# Altium project QUTMS 2021 Shutdown Redesign.PrjPcb
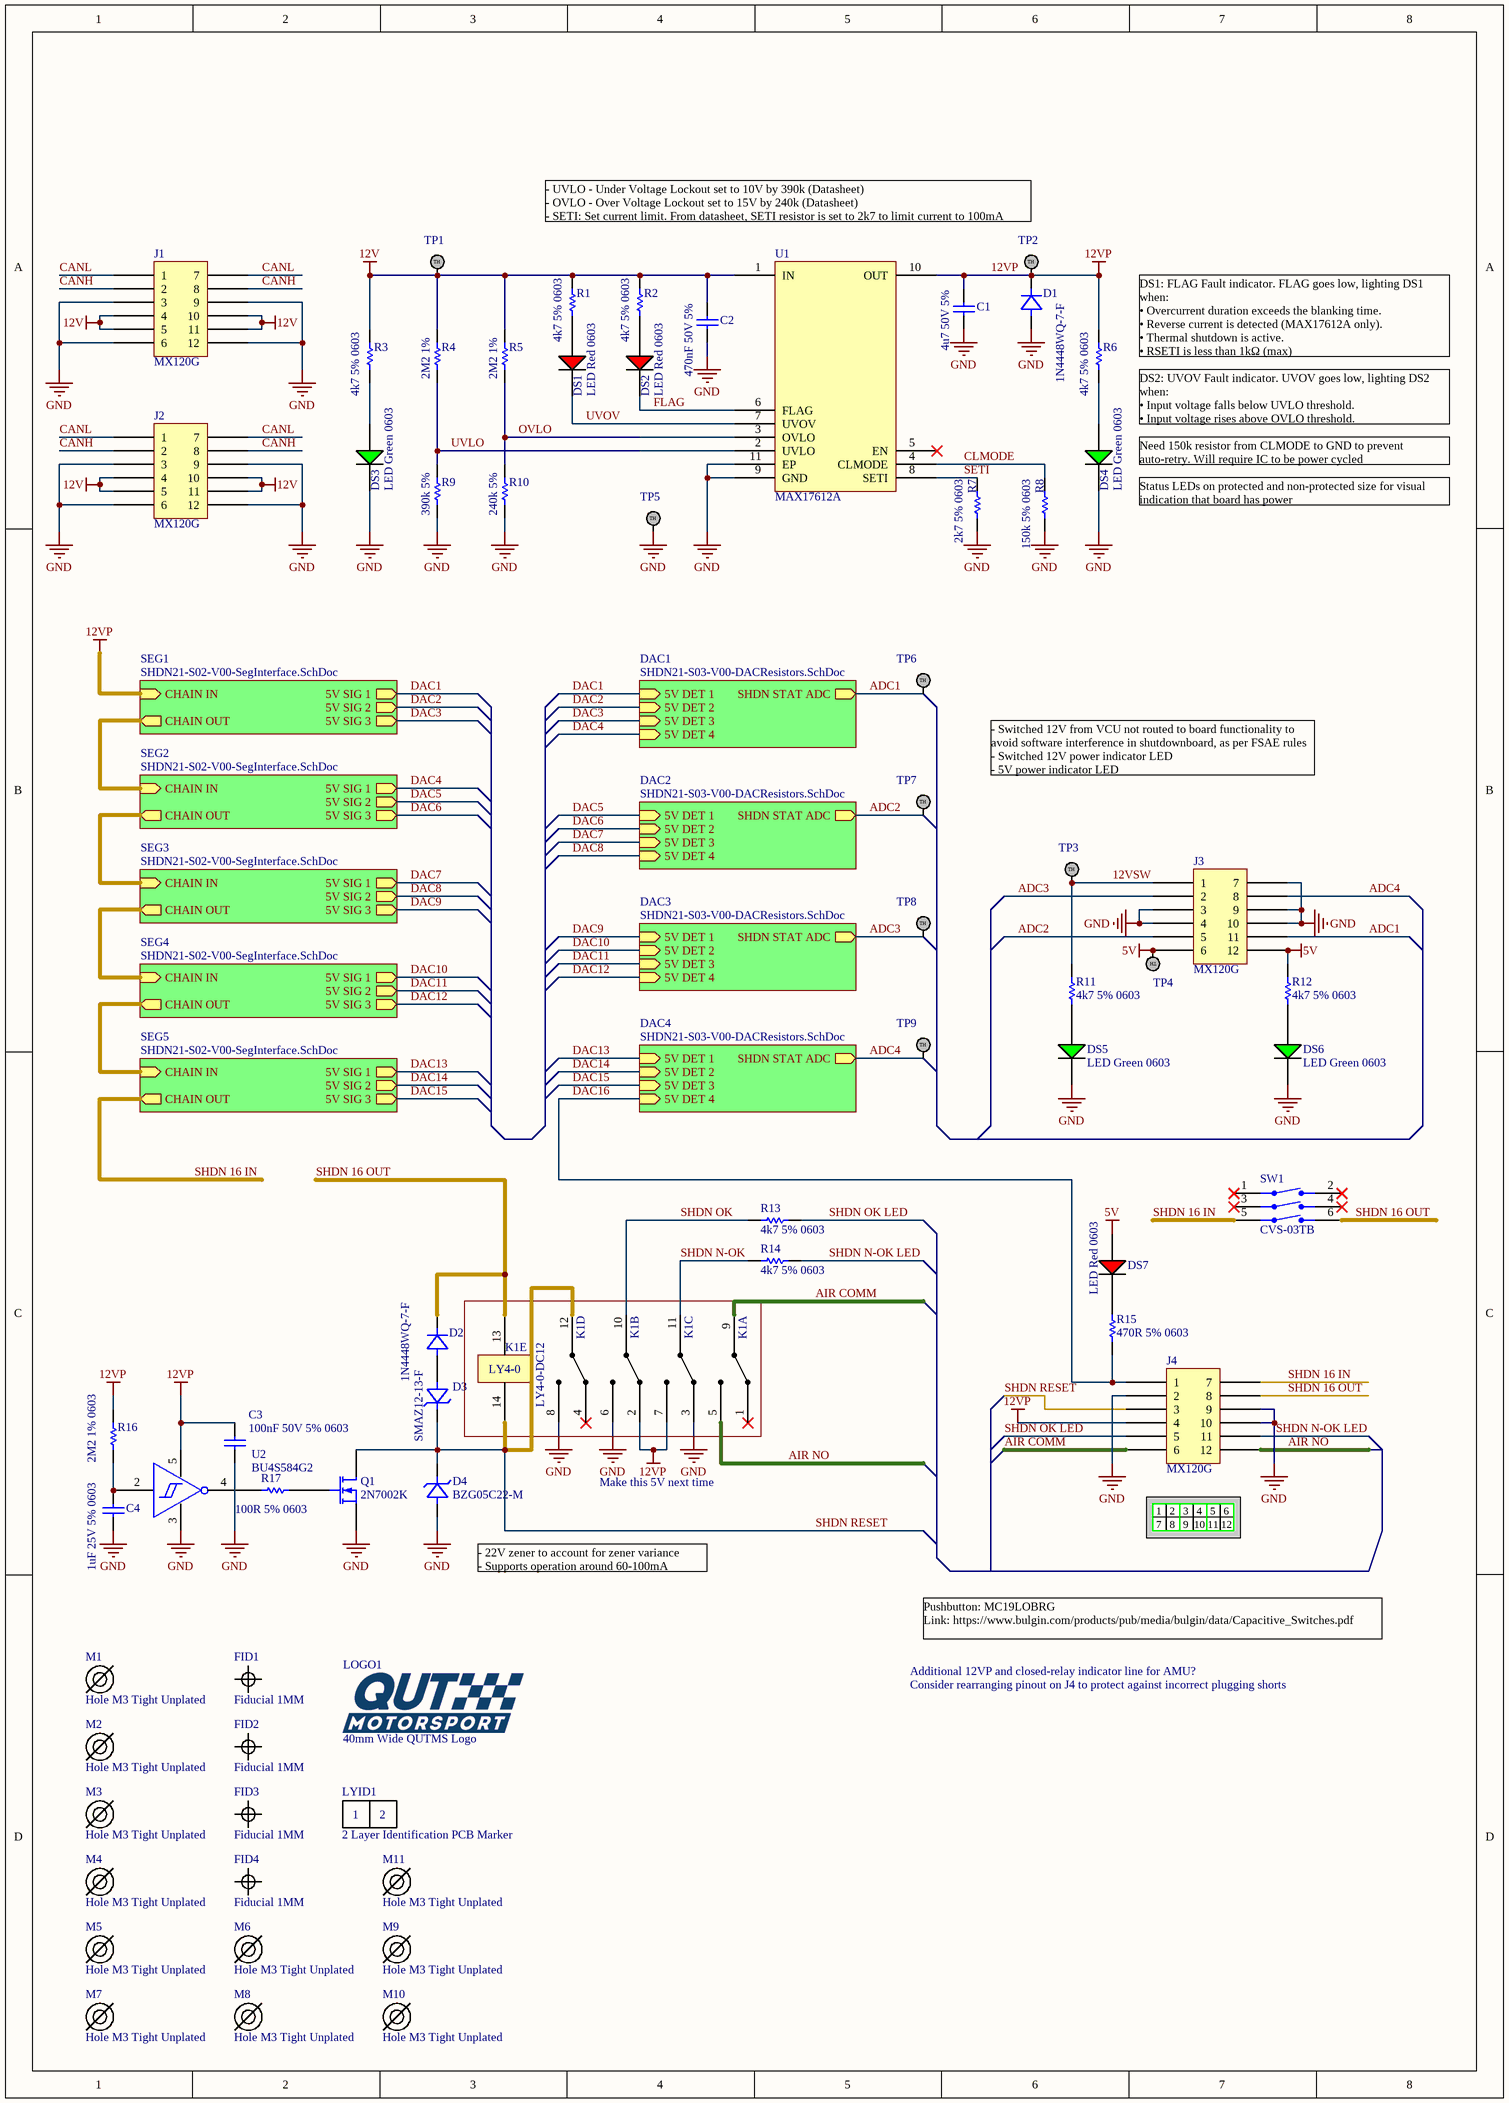
[diagram p0: SHDN21-S01-V00-Shutdown.SchDoc]
3 sheets, 131 parts. Net scope: hierarchical (ports join the sheet entries above them; power ports are global).
Board file: SHDN21-P01-V00.PcbDoc
Sheets:
  SHDN21-S01-V00-Shutdown.SchDoc
    SEG1 = SHDN21-S02-V00-SegInterface.SchDoc
    SEG2 = SHDN21-S02-V00-SegInterface.SchDoc
    SEG3 = SHDN21-S02-V00-SegInterface.SchDoc
    SEG4 = SHDN21-S02-V00-SegInterface.SchDoc
    SEG5 = SHDN21-S02-V00-SegInterface.SchDoc
    DAC1 = SHDN21-S03-V00-DACResistors.SchDoc
    DAC2 = SHDN21-S03-V00-DACResistors.SchDoc
    DAC3 = SHDN21-S03-V00-DACResistors.SchDoc
    DAC4 = SHDN21-S03-V00-DACResistors.SchDoc

## Sheet SHDN21-S01-V00-Shutdown.SchDoc
size A3 portrait

### Parts
C1  4u7 50V 5%  [Cap_Ceramic_0603]
C2  470nF 50V 5%  [Cap_Ceramic_0603]
C3  100nF 50V 5% 0603  [Cap_Ceramic_0603]
C4  1uF 25V 5% 0603  [Cap_Ceramic_0603]
D1  1N4448WQ-7-F  [SMA]
D2  1N4448WQ-7-F  [SMA]
D3  SMAZ12-13-F  [SMA]
D4  BZG05C22-M  [SMA]
DS1  LED Red 0603  [LED RED 0603]
DS2  LED Red 0603  [LED RED 0603]
DS3  LED Green 0603  [LED GREEN 0603]
DS4  LED Green 0603  [LED GREEN 0603]
DS5  LED Green 0603  [LED GREEN 0603]
DS6  LED Green 0603  [LED GREEN 0603]
DS7  LED Red 0603  [LED RED 0603]
FID1  Fiducial 1MM  [FIDUCIAL 1MM]
FID2  Fiducial 1MM  [FIDUCIAL 1MM]
FID3  Fiducial 1MM  [FIDUCIAL 1MM]
FID4  Fiducial 1MM  [FIDUCIAL 1MM]
J1  MX120G  [MX120G]
J2  MX120G  [MX120G]
J3  MX120G  [MX120G]
J4  MX120G  [MX120G]
K1  LY4-0-DC12  [LY4-0-DC12]  (value not drawn)  (parts A,B,C,D,E of 5)
LOGO1  40mm Wide QUTMS Logo  [QUTMS LOGO 40MM]
LYID1  2 Layer Identification PCB Marker  [LAYER IDENT 2]
M1  Hole M3 Tight Unplated  [M3.2 UNPLATED]
M2  Hole M3 Tight Unplated  [M3.2 UNPLATED]
M3  Hole M3 Tight Unplated  [M3.2 UNPLATED]
M4  Hole M3 Tight Unplated  [M3.2 UNPLATED]
M5  Hole M3 Tight Unplated  [M3.2 UNPLATED]
M6  Hole M3 Tight Unplated  [M3.2 UNPLATED]
M7  Hole M3 Tight Unplated  [M3.2 UNPLATED]
M8  Hole M3 Tight Unplated  [M3.2 UNPLATED]
M9  Hole M3 Tight Unplated  [M3.2 UNPLATED]
M10  Hole M3 Tight Unplated  [M3.2 UNPLATED]
M11  Hole M3 Tight Unplated  [M3.2 UNPLATED]
Q1  2N7002K  [SOT-23-3]
R1  4k7 5% 0603  [Res_ThinFilm_0603]
R2  4k7 5% 0603  [Res_ThinFilm_0603]
R3  4k7 5% 0603  [Res_ThinFilm_0603]
R4  2M2 1%  [Res_ThinFilm_0603]
R5  2M2 1%  [Res_ThinFilm_0603]
R6  4k7 5% 0603  [Res_ThinFilm_0603]
R7  2k7 5% 0603  [Res_ThinFilm_0603]
R8  150k 5% 0603  [Res_ThinFilm_0603]
R9  390k 5%  [Res_ThinFilm_0603]
R10  240k 5%  [Res_ThinFilm_0603]
R11  4k7 5% 0603  [Res_ThinFilm_0603]
R12  4k7 5% 0603  [Res_ThinFilm_0603]
R13  4k7 5% 0603  [Res_ThinFilm_0603]
R14  4k7 5% 0603  [Res_ThinFilm_0603]
R15  470R 5% 0603  [Res_ThinFilm_0603]
R16  2M2 1% 0603  [Res_ThinFilm_0603]
R17  100R 5% 0603  [Res_ThinFilm_0603]
SW1  CVS-03TB  [CVS-03TB]
TP1  TestPoint  [TestPoint]  (value not drawn)
TP2  TestPoint  [TestPoint]  (value not drawn)
TP3  TestPoint  [TestPoint]  (value not drawn)
TP4  TestPoint  [TestPoint]  (value not drawn)
TP5  TestPoint  [TestPoint]  (value not drawn)
TP6  TestPoint  [TestPoint]  (value not drawn)
TP7  TestPoint  [TestPoint]  (value not drawn)
TP8  TestPoint  [TestPoint]  (value not drawn)
TP9  TestPoint  [TestPoint]  (value not drawn)
U1  MAX17612A  [10-Pin TDFN EP]
U2  BU4S584G2  [SSOP5]

### Sub-sheets
DAC1 = SHDN21-S03-V00-DACResistors.SchDoc: 5V DET 1 (in), SHDN STAT ADC (out), 5V DET 2 (in), 5V DET 3 (in), 5V DET 4 (in)
DAC2 = SHDN21-S03-V00-DACResistors.SchDoc: 5V DET 1 (in), SHDN STAT ADC (out), 5V DET 2 (in), 5V DET 3 (in), 5V DET 4 (in)
DAC3 = SHDN21-S03-V00-DACResistors.SchDoc: 5V DET 1 (in), SHDN STAT ADC (out), 5V DET 2 (in), 5V DET 3 (in), 5V DET 4 (in)
DAC4 = SHDN21-S03-V00-DACResistors.SchDoc: 5V DET 1 (in), SHDN STAT ADC (out), 5V DET 2 (in), 5V DET 3 (in), 5V DET 4 (in)
SEG1 = SHDN21-S02-V00-SegInterface.SchDoc: CHAIN IN (in), 5V SIG 1 (out), 5V SIG 2 (out), 5V SIG 3 (out), CHAIN OUT (out)
SEG2 = SHDN21-S02-V00-SegInterface.SchDoc: CHAIN IN (in), 5V SIG 1 (out), 5V SIG 2 (out), 5V SIG 3 (out), CHAIN OUT (out)
SEG3 = SHDN21-S02-V00-SegInterface.SchDoc: CHAIN IN (in), 5V SIG 1 (out), 5V SIG 2 (out), 5V SIG 3 (out), CHAIN OUT (out)
SEG4 = SHDN21-S02-V00-SegInterface.SchDoc: CHAIN IN (in), 5V SIG 1 (out), 5V SIG 2 (out), 5V SIG 3 (out), CHAIN OUT (out)
SEG5 = SHDN21-S02-V00-SegInterface.SchDoc: CHAIN IN (in), 5V SIG 1 (out), 5V SIG 2 (out), 5V SIG 3 (out), CHAIN OUT (out)

### Nets
5V: DS7.1(A) J3.6 J3.12 R12.2 TP4.1
12V: C2.2 J1.4 J1.5 J1.10 J1.11 J2.4 J2.5 J2.10 J2.11 R1.2 R2.2 R3.2 R4.2 R5.2 TP1.1 U1.1(IN)
12VP: C1.2 C3.1 D1.K(Cathode) J4.4 K1.2 K1.7 R6.2 R16.2 TP2.1 U1.10(OUT) U2.5(VDD) ; sheet SEG1/CHAIN IN
GND: C1.1 C2.1 C3.2 C4.1 D1.A(Anode) D4.A(Anode) DS3.2(C) DS4.2(C) DS5.2(C) DS6.2(C) J1.3 J1.6 J1.9 J1.12 J2.3 J2.6 J2.9 J2.12 J3.3 J3.4 J3.7 J3.9 J3.10 J4.2 J4.9 J4.10 K1.3 K1.6 K1.8 Q1.S R7.2 R8.1 R9.1 R10.1 TP5.1 U1.9(GND) U1.11(EP) U2.3(VSS)
12VSW: J3.1 R11.2 TP3.1
ADC1: J3.11 TP6.1 ; sheet DAC1/SHDN STAT ADC
ADC2: J3.5 TP7.1 ; sheet DAC2/SHDN STAT ADC
ADC3: J3.2 TP8.1 ; sheet DAC3/SHDN STAT ADC
ADC4: J3.8 TP9.1 ; sheet DAC4/SHDN STAT ADC
AIR COMM: J4.6 K1.9
AIR NO: J4.12 K1.5
CANH: J1.2 J1.8 J2.2 J2.8
CANL: J1.1 J1.7 J2.1 J2.7
CHAIN IN: sheet SEG1/CHAIN OUT, sheet SEG2/CHAIN IN
CHAIN IN: sheet SEG2/CHAIN OUT, sheet SEG3/CHAIN IN  [a separate net that carries the same name]
CHAIN IN: sheet SEG3/CHAIN OUT, sheet SEG4/CHAIN IN  [a separate net that carries the same name]
CHAIN IN: sheet SEG4/CHAIN OUT, sheet SEG5/CHAIN IN  [a separate net that carries the same name]
CLMODE: R8.2 U1.4(CLMODE)
DAC1: sheet SEG1/5V SIG 1, sheet DAC1/5V DET 1
DAC2: sheet SEG1/5V SIG 2, sheet DAC1/5V DET 2
DAC3: sheet SEG1/5V SIG 3, sheet DAC1/5V DET 3
DAC4: sheet SEG2/5V SIG 1, sheet DAC1/5V DET 4
DAC5: sheet SEG2/5V SIG 2, sheet DAC2/5V DET 1
DAC6: sheet SEG2/5V SIG 3, sheet DAC2/5V DET 2
DAC7: sheet SEG3/5V SIG 1, sheet DAC2/5V DET 3
DAC8: sheet SEG3/5V SIG 2, sheet DAC2/5V DET 4
DAC9: sheet SEG3/5V SIG 3, sheet DAC3/5V DET 1
DAC10: sheet SEG4/5V SIG 1, sheet DAC3/5V DET 2
DAC11: sheet SEG4/5V SIG 2, sheet DAC3/5V DET 3
DAC12: sheet SEG4/5V SIG 3, sheet DAC3/5V DET 4
DAC13: sheet SEG5/5V SIG 1, sheet DAC4/5V DET 1
DAC14: sheet SEG5/5V SIG 2, sheet DAC4/5V DET 2
DAC15: sheet SEG5/5V SIG 3, sheet DAC4/5V DET 3
DAC16: J4.1 R15.1 ; sheet DAC4/5V DET 4
FLAG: DS2.2(C) U1.6(FLAG)
OVLO: R5.1 R10.2 U1.3(OVLO)
SETI: R7.1 U1.8(SETI)
SHDN 16 IN: J4.7 SW1.5 ; sheet SEG5/CHAIN OUT  [project net CHAIN OUT]
SHDN 16 OUT: D2.K(Cathode) J4.8 K1.13 SW1.6
SHDN N-OK: K1.11 R14.1
SHDN N-OK LED: J4.11 R14.2
SHDN OK: K1.10 R13.1
SHDN OK LED: J4.5 R13.2
SHDN RESET: D3.K(Cathode) D4.K(Cathode) J4.3 K1.12 K1.14 Q1.D
UVLO: R4.1 R9.2 U1.2(UVLO)
UVOV: DS1.2(C) U1.7(UVOV)
NetC4_2: C4.2 R16.1 U2.2(A)
NetD2_A: D2.A(Anode) D3.A(Anode)
NetDS1_1: DS1.1(A) R1.1
NetDS2_1: DS2.1(A) R2.1
NetDS3_1: DS3.1(A) R3.1
NetDS4_1: DS4.1(A) R6.1
NetDS5_1: DS5.1(A) R11.1
NetDS6_1: DS6.1(A) R12.1
NetDS7_2: DS7.2(C) R15.2
NetQ1_G: Q1.G R17.2
NetR17_1: R17.1 U2.4(Y)

Not connected (* = marked no-connect by the designer): K1 1* 4*; SW1 1* 2* 3* 4*; U1 5(EN)*

### Notes on the sheet
- - UVLO - Under Voltage Lockout set to 10V by 390k (Datasheet)
  - OVLO - Over Voltage Lockout set to 15V by 240k (Datasheet)
  - SETI: Set current limit. From datasheet, SETI resistor is set to 2k7 to limit current to 100mA
- (near R6) DS1: FLAG Fault indicator. FLAG goes low, lighting DS1 when:
  • Overcurrent duration exceeds the blanking time.
  • Reverse current is detected (MAX17612A only).
  • Thermal shutdown is active.
  • RSETI is less than 1kΩ (max)
- DS2: UVOV Fault indicator. UVOV goes low, lighting DS2 when:
  • Input voltage falls below UVLO threshold.
  • Input voltage rises above OVLO threshold.
- (near DS4) Need 150k resistor from CLMODE to GND to prevent auto-retry. Will require IC to be power cycled
- (near DS4) Status LEDs on protected and non-protected size for visual indication that board has power
- - Switched 12V from VCU not routed to board functionality to avoid software interference in shutdownboard, as per FSAE rules
  - Switched 12V power indicator LED
  - 5V power indicator LED
- Make this 5V next time
- 1
- 2
- 3
- 4
- 5
- 6
- - 22V zener to account for zener variance
  - Supports operation around 60-100mA
- 7
- 8
- 9
- 10
- 11
- 12
- Pushbutton: MC19LOBRG
  Link: https://www.bulgin.com/products/pub/media/bulgin/data/Capacitive_Switches.pdf
- Additional 12VP and closed-relay indicator line for AMU?
- Consider rearranging pinout on J4 to protect against incorrect plugging shorts
- (in symbol Layer Identification 2) 1; 2
- (in symbol LY4-0-DC12_Parts, part E) LY4-0
- (in symbol TestPoint) TH

### Library data of the parts
C1 = 4u7 50V 5% X7R 0603: Capacitor, Ceramic, SMD, 4u7, 50V, 5%, X7R, 0603
C2 = 470nF 50V 5% X7R 0603: Capacitor, Ceramic, SMD, 470nF, 50V, 5%, X7R, 0603
C3 = 100nF 50V 5% X7R 0603: Capacitor, Ceramic, SMD, 100nF, 50V, 5%, X7R, 0603
C4 = 1uF 25V 5% X7R 0603: Capacitor, Ceramic, SMD, 1uF, 25V, 5%, X7R, 0603
D1 D2 = 1N4448WQ-7-F: Diode, SMD, 75V, 5%, 250mA, SOD123; Manufacturer: ON Semiconductor / Fairchild; Manufacturer Part Number: 1N914BWS; Average Rectified Current: 150mA; Element Configuration: Single; Forward Voltage: 1V; Max Reverse Leakage Current: 5uA; Power Dissipation: 200mW; Recovery Time: 4ns; Max Forward Surge Current (Ifsm): 4A; Parameter 1: *; Weight: 0.0276g; Category: Rectifier Diodes; Contact Plating: Tin,Matte; Forward Current: 150mA; Lead Free: Lead Free; Max Operating Temperature: 150°C; Max Repetitive Reverse Voltage (Vrrm): 75V; Max Reverse Voltage (DC): 75V; Min Operating Temperature: -55°C; Mount: Surface Mount; Number of Pins: 2; Package Quantity: 1; Packaging: Tape and Reel; Peak Reverse Current: 5uA; Radiation Hardening: No; REACH SVHC: No SVHC; Reverse Recovery Time: 4ns; Height: 1mm; Length: 1.8mm; Reverse Voltage: 75V; Width: 1.35mm
D3 = SMAZ12-13-F: Zener Diode 12V 1W ±5% Surface Mount SMA; Manufacturer: ON Semiconductor; MPN: MM3Z56VB; ComponentLink1Description: Digikey; ComponentLink1URL: https://www.digikey.com.au/product-detail/en/diodes-incorporated/SMAZ12-13-F/SMAZ12-FDICT-ND/725073; ComponentLink2Description: Datasheet; ComponentLink2URL: https://www.diodes.com/assets/Datasheets/ds18015.pdf
D4 = BZG05C22-M: Zener Diodes Uni-direc 40W Pppm SMA (DO-214AC); ComponentLink1Description: Datasheet; ComponentLink1URL: https://au.mouser.com/datasheet/2/427/bzg05c-m-series-1767829.pdf
J1-J4 = MX120G: MX120G with standard connector layout
K1 = LY4-0-DC12_Parts: RELAY GEN PURPOSE 4PDT 10A 12V Through-hole
LOGO1 = QUTMS Logo 40mm
LYID1 = Layer Identification 2
M1-M11 = Hole M3 Tight Unplated: M3.2 Hole, No Plating
Q1 = 2N7002K: N-Channel 60V 300mA (Ta) 350mW (Ta) Surface Mount SOT-23 (TO-236AB)
R1-R3 R6 R11-R14 = 4k7 5% 0603: Resistor, SMD, 4k7, 0.1W, 5%, 0603
R4 R5 R16 = 2M2 1% 0603: Resistor, SMD, 2M2, 0.125W, 1%, 0603
R7 = 2k7 5% 0603: Resistor, SMD, 2k7, 0.1W, 5%, 0603
R8 = 150k 5%, 0603: Resistor, SMD, 150k, 0.1W, 5%, 0603
R9 = 390k 5% 0603: Resistor, SMD, 390k, 0.1W, 5%, 0603
R10 = 240k 5% 0603: Resistor, SMD, 240k, 0.1W, 5%, 0603
R15 = 470R 5% 0603: Resistor, SMD, 470R, 0.1W, 5%, 0603
R17 = 100R 5%, 0603: Resistor, SMD, 100R, 0.1W, 5%, 0603
SW1 = CVS-03TB: SWITCH SLIDE DIP SPST 100MA 6V
U2 = BU4S584G2: IC INVERTER SCHMITT 1CH 5SSOP

## Sheet SHDN21-S02-V00-SegInterface.SchDoc
size A4
Used 5 times, as channels SEG1, SEG2, SEG3, SEG4, SEG5. Parts and nets are listed once, with the designators drawn on the sheet.
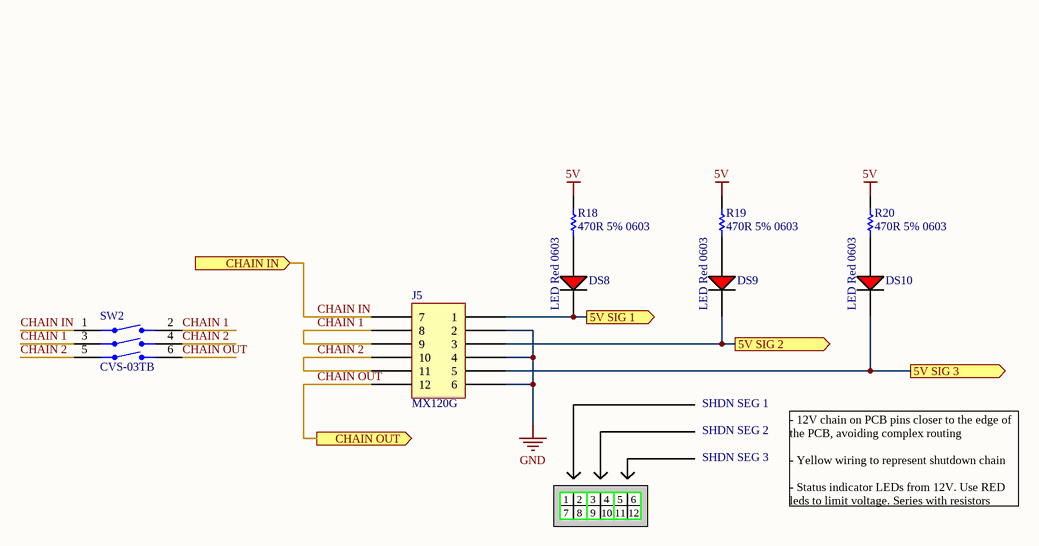
[diagram p1: SHDN21-S02-V00-SegInterface.SchDoc]

### Parts
DS8  LED Red 0603  [LED RED 0603]
DS9  LED Red 0603  [LED RED 0603]
DS10  LED Red 0603  [LED RED 0603]
J5  MX120G  [MX120G]
R18  470R 5% 0603  [Res_ThinFilm_0603]
R19  470R 5% 0603  [Res_ThinFilm_0603]
R20  470R 5% 0603  [Res_ThinFilm_0603]
SW2  CVS-03TB  [CVS-03TB]

### Ports
5V SIG 1 (out), 5V SIG 2 (out), 5V SIG 3 (out), CHAIN IN (in), CHAIN OUT (out)

### Nets
5V: R18.2 R19.2 R20.2
GND: J5.2 J5.4 J5.6
5V SIG 1: DS8.2(C) J5.1 ; port 5V SIG 1
5V SIG 2: DS9.2(C) J5.3 ; port 5V SIG 2
5V SIG 3: DS10.2(C) J5.5 ; port 5V SIG 3
CHAIN 1: J5.8 J5.9 SW2.2 SW2.3
CHAIN 2: J5.10 J5.11 SW2.4 SW2.5
CHAIN IN: J5.7 SW2.1 ; port CHAIN IN
CHAIN OUT: J5.12 SW2.6 ; port CHAIN OUT
NetDS8_1: DS8.1(A) R18.1
NetDS9_1: DS9.1(A) R19.1
NetDS10_1: DS10.1(A) R20.1

### Channels
SEG1: designators DS8=DS8-1 DS9=DS9-1 DS10=DS10-1 J5=J6_SEG1 R18=R18-1 R19=R19-1 R20=R20-1 SW2=SW2-1; ports 5V SIG 1=DAC1 5V SIG 2=DAC2 5V SIG 3=DAC3 CHAIN IN=12VP CHAIN OUT=CHAIN IN
SEG2: designators DS8=DS8-2 DS9=DS9-2 DS10=DS10-2 J5=J6_SEG2 R18=R18-2 R19=R19-2 R20=R20-2 SW2=SW2-2; ports 5V SIG 1=DAC4 5V SIG 2=DAC5 5V SIG 3=DAC6 CHAIN IN=CHAIN IN CHAIN OUT=CHAIN IN
SEG3: designators DS8=DS8-3 DS9=DS9-3 DS10=DS10-3 J5=J6_SEG3 R18=R18-3 R19=R19-3 R20=R20-3 SW2=SW2-3; ports 5V SIG 1=DAC7 5V SIG 2=DAC8 5V SIG 3=DAC9 CHAIN IN=CHAIN IN CHAIN OUT=CHAIN IN
SEG4: designators DS8=DS8-4 DS9=DS9-4 DS10=DS10-4 J5=J6_SEG4 R18=R18-4 R19=R19-4 R20=R20-4 SW2=SW2-4; ports 5V SIG 1=DAC10 5V SIG 2=DAC11 5V SIG 3=DAC12 CHAIN IN=CHAIN IN CHAIN OUT=CHAIN IN
SEG5: designators DS8=DS8-5 DS9=DS9-5 DS10=DS10-5 J5=J6_SEG5 R18=R18-5 R19=R19-5 R20=R20-5 SW2=SW2-5; ports 5V SIG 1=DAC13 5V SIG 2=DAC14 5V SIG 3=DAC15 CHAIN IN=CHAIN IN CHAIN OUT=CHAIN OUT

### Notes on the sheet
- SHDN SEG 1
- SHDN SEG 2
- SHDN SEG 3
- 1
- 7
- 2
- 8
- 3
- 9
- 4
- 10
- 5
- 11
- 6
- 12
- - 12V chain on PCB pins closer to the edge of the PCB, avoiding complex routing
  - Yellow wiring to represent shutdown chain
  - Status indicator LEDs from 12V. Use RED leds to limit voltage. Series with resistors

### Library data of the parts
J5 = MX120G: MX120G with standard connector layout
R18-R20 = 470R 5% 0603: Resistor, SMD, 470R, 0.1W, 5%, 0603
SW2 = CVS-03TB: SWITCH SLIDE DIP SPST 100MA 6V

## Sheet SHDN21-S03-V00-DACResistors.SchDoc
size A4
Used 4 times, as channels DAC1, DAC2, DAC3, DAC4. Parts and nets are listed once, with the designators drawn on the sheet.
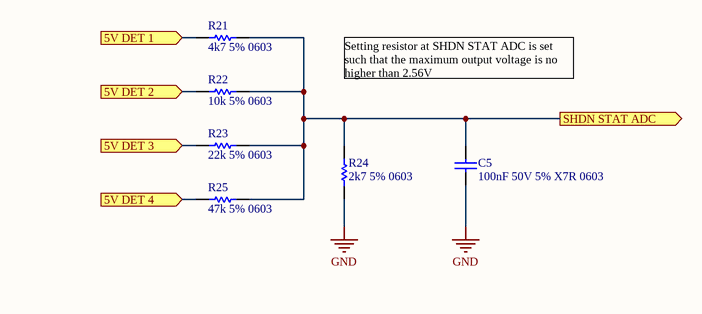
[diagram p2: SHDN21-S03-V00-DACResistors.SchDoc]

### Parts
C5  100nF 50V 5% X7R 0603  [Cap_Ceramic_0603]
R21  4k7 5% 0603  [Res_ThinFilm_0603]
R22  10k 5% 0603  [Res_ThinFilm_0603]
R23  22k 5% 0603  [Res_ThinFilm_0603]
R24  2k7 5% 0603  [Res_ThinFilm_0603]
R25  47k 5% 0603  [Res_ThinFilm_0603]

### Ports
5V DET 1 (in), 5V DET 2 (in), 5V DET 3 (in), 5V DET 4 (in), SHDN STAT ADC (out)

### Nets
GND: C5.1 R24.1
5V DET 1: R21.1 ; port 5V DET 1
5V DET 2: R22.1 ; port 5V DET 2
5V DET 3: R23.1 ; port 5V DET 3
5V DET 4: R25.1 ; port 5V DET 4
SHDN STAT ADC: C5.2 R21.2 R22.2 R23.2 R24.2 R25.2 ; port SHDN STAT ADC

### Channels
DAC1: designators C5=C5-1 R21=R21_DAC1 R22=R22_DAC1 R23=R23_DAC1 R24=R24_DAC1 R25=R25_DAC1; ports 5V DET 1=DAC1 5V DET 2=DAC2 5V DET 3=DAC3 5V DET 4=DAC4 SHDN STAT ADC=ADC1
DAC2: designators C5=C5-2 R21=R21_DAC2 R22=R22_DAC2 R23=R23_DAC2 R24=R24_DAC2 R25=R25_DAC2; ports 5V DET 1=DAC5 5V DET 2=DAC6 5V DET 3=DAC7 5V DET 4=DAC8 SHDN STAT ADC=ADC2
DAC3: designators C5=C5-3 R21=R21_DAC3 R22=R22_DAC3 R23=R23_DAC3 R24=R24_DAC3 R25=R25_DAC3; ports 5V DET 1=DAC9 5V DET 2=DAC10 5V DET 3=DAC11 5V DET 4=DAC12 SHDN STAT ADC=ADC3
DAC4: designators end in -4; ports 5V DET 1=DAC13 5V DET 2=DAC14 5V DET 3=DAC15 5V DET 4=DAC16 SHDN STAT ADC=ADC4

### Notes on the sheet
- Setting resistor at SHDN STAT ADC is set such that the maximum output voltage is no higher than 2.56V

### Library data of the parts
C5 = 100nF 50V 5% X7R 0603: as C3 on sheet SHDN21-S01-V00-Shutdown
R21 = 4k7 5% 0603: Resistor, SMD, 4k7, 0.1W, 5%, 0603
R22 = 10k 5% 0603: Resistor, SMD, 10k, 0.1W, 5%, 0603
R23 = 22k 5% 0603: Resistor, SMD, 22k, 0.1W, 5%, 0603
R24 = 2k7 5% 0603: Resistor, SMD, 2k7, 0.1W, 5%, 0603
R25 = 47k 5% 0603: Resistor, SMD, 47k, 0.1W, 5%, 0603

## Nets that join several sheets
5V: SHDN21-S01-V00-Shutdown (5 pins), SEG1 (R18-1.2 R19-1.2 R20-1.2), SEG2 (R18-2.2 R19-2.2 R20-2.2), SEG3 (R18-3.2 R19-3.2 R20-3.2), SEG4 (R18-4.2 R19-4.2 R20-4.2), SEG5 (R18-5.2 R19-5.2 R20-5.2)
12VP: SHDN21-S01-V00-Shutdown (11 pins), SEG1 (J6_SEG1.7 SW2-1.1)
GND: SHDN21-S01-V00-Shutdown (38 pins), SEG1 (J6_SEG1.2 J6_SEG1.4 J6_SEG1.6), SEG2 (J6_SEG2.2 J6_SEG2.4 J6_SEG2.6), SEG3 (J6_SEG3.2 J6_SEG3.4 J6_SEG3.6), SEG4 (J6_SEG4.2 J6_SEG4.4 J6_SEG4.6), SEG5 (J6_SEG5.2 J6_SEG5.4 J6_SEG5.6), DAC1 (C5-1.1 R24_DAC1.1), DAC2 (C5-2.1 R24_DAC2.1), DAC3 (C5-3.1 R24_DAC3.1), DAC4 (C5-4.1 R24-4.1)
ADC1: SHDN21-S01-V00-Shutdown (J3.11 TP6.1), DAC1 (6 pins)
ADC2: SHDN21-S01-V00-Shutdown (J3.5 TP7.1), DAC2 (6 pins)
ADC3: SHDN21-S01-V00-Shutdown (J3.2 TP8.1), DAC3 (6 pins)
ADC4: SHDN21-S01-V00-Shutdown (J3.8 TP9.1), DAC4 (6 pins)
CHAIN IN: SEG1 (J6_SEG1.12 SW2-1.6), SEG2 (J6_SEG2.7 SW2-2.1)
CHAIN IN: SEG2 (J6_SEG2.12 SW2-2.6), SEG3 (J6_SEG3.7 SW2-3.1)
CHAIN IN: SEG3 (J6_SEG3.12 SW2-3.6), SEG4 (J6_SEG4.7 SW2-4.1)
CHAIN IN: SEG4 (J6_SEG4.12 SW2-4.6), SEG5 (J6_SEG5.7 SW2-5.1)
CHAIN OUT: SHDN21-S01-V00-Shutdown (J4.7 SW1.5), SEG5 (J6_SEG5.12 SW2-5.6)
DAC1: SEG1 (DS8-1.2 J6_SEG1.1), DAC1 (R21_DAC1.1)
DAC2: SEG1 (DS9-1.2 J6_SEG1.3), DAC1 (R22_DAC1.1)
DAC3: SEG1 (DS10-1.2 J6_SEG1.5), DAC1 (R23_DAC1.1)
DAC4: SEG2 (DS8-2.2 J6_SEG2.1), DAC1 (R25_DAC1.1)
DAC5: SEG2 (DS9-2.2 J6_SEG2.3), DAC2 (R21_DAC2.1)
DAC6: SEG2 (DS10-2.2 J6_SEG2.5), DAC2 (R22_DAC2.1)
DAC7: SEG3 (DS8-3.2 J6_SEG3.1), DAC2 (R23_DAC2.1)
DAC8: SEG3 (DS9-3.2 J6_SEG3.3), DAC2 (R25_DAC2.1)
DAC9: SEG3 (DS10-3.2 J6_SEG3.5), DAC3 (R21_DAC3.1)
DAC10: SEG4 (DS8-4.2 J6_SEG4.1), DAC3 (R22_DAC3.1)
DAC11: SEG4 (DS9-4.2 J6_SEG4.3), DAC3 (R23_DAC3.1)
DAC12: SEG4 (DS10-4.2 J6_SEG4.5), DAC3 (R25_DAC3.1)
DAC13: SEG5 (DS8-5.2 J6_SEG5.1), DAC4 (R21-4.1)
DAC14: SEG5 (DS9-5.2 J6_SEG5.3), DAC4 (R22-4.1)
DAC15: SEG5 (DS10-5.2 J6_SEG5.5), DAC4 (R23-4.1)
DAC16: SHDN21-S01-V00-Shutdown (J4.1 R15.1), DAC4 (R25-4.1)